# EAGLE design circle_barometer (EAGLE 7.4.0)
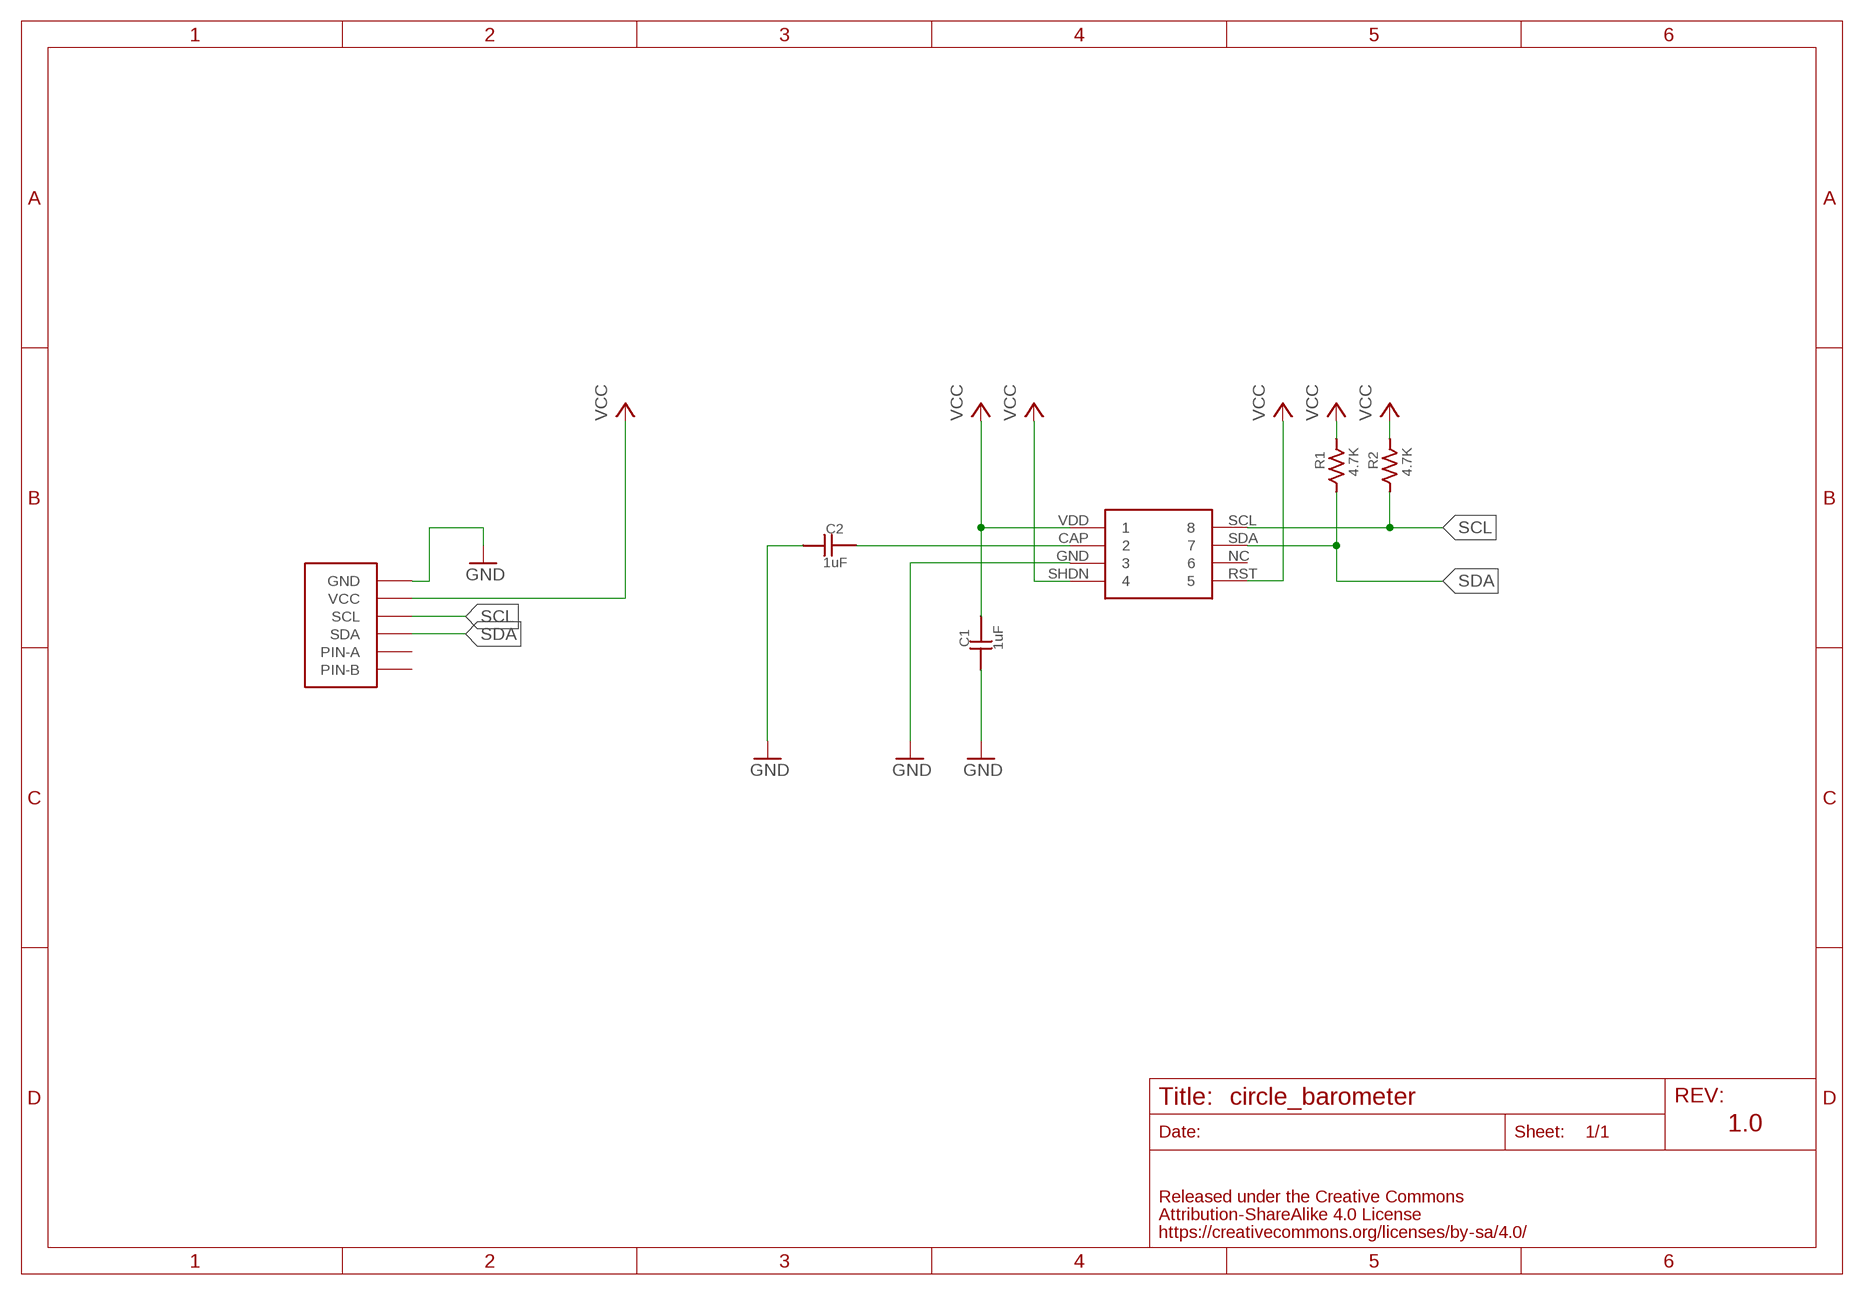
[diagram p0: schematic, sheet 1]

## Parts
C1  1uF  CAPACITOR0402  [0402]
C2  1uF  CAPACITOR0402  [0402]
R1  4.7K  RESISTOR-0402  [0402]
R2  4.7K  RESISTOR-0402  [0402]
U$2  I2C-MPL115A2  [I2C-MLP115A2]
U$4  FABO-NANO  [FABO-NANO]

## Nets
GND: C1.P$1 C2.P$1 U$2.GND U$4.GND
N$1: C2.P$2 U$2.CAP
SCL: R2.P$1 U$2.SCL U$4.0(SCL)
SDA: R1.P$1 U$2.SDA U$4.1(SDA)
VCC: C1.P$2 R1.P$2 R2.P$2 U$2.RST U$2.SHDN U$2.VDD
Unconnected: U$2.NC U$4.2(PIN-A) U$4.3(PIN-B) U$4.VCC

## Notes on the sheet
- 1.0

## Library data of the parts
C1 C2 = FaBo-Capacitor:CAPACITOR: CAPACITOR
R1 R2 = FaBo-Resistors:RESISTOR: RESISTOR
U$2 = gclue:I2C-MPL115A2
U$4 = FaBo-Template:FABO-NANO

## Board
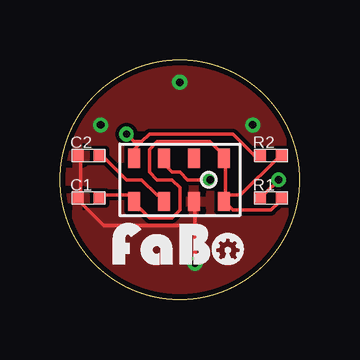
[diagram p1: board, top side]
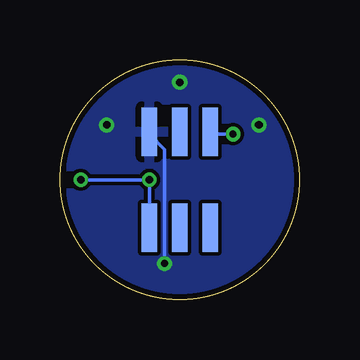
[diagram p2: board, bottom side, seen from below]

Size 10 x 10 mm. Coordinates in mm from the lower left corner, seen from the top.
Copper layers (1*16): Top 0.035mm / dielectric 1.5mm / Bottom 0.035mm
Design rules "SeeedStudio_2layer_DRU_no_angle_20140221": minimum track width 6mil, minimum drill 12mil, track to track 6mil, track to pad 6mil, pad to pad 6mil, via to via 6mil, smd to smd 0mil, copper to edge 10mil, drill to drill 10mil, minimum pad ring 10mil, minimum via ring 6mil, stop-mask expansion 2mil, vias tented up to drill 100mil, thermal gap 10mil

### Footprints (pad centres in the part's own frame; a part is rotated, then mirrored left to right if it is on the bottom)
0402 = smd 0.5 x 0.5: P$1 -0.46,0; P$2 0.46,0
I2C-MLP115A2 = smd 0.8 x 0.5: CAP -0.9,0.65; GND -0.9,-0.6; NC 0.9,-0.6; RST 0.9,-1.85; SCL 0.9,1.9; SDA 0.9,0.65; SHDN -0.9,-1.85; VDD -0.9,1.9
FABO-NANO = smd 0.635 x 2.032 bottom: 0 -1.27,2; 1 1.27,-2; 2 0,-2; 3 -1.27,-2; GND 1.27,2; VCC 0,2

### Placement (x,y rotation side)
C1  1.19,4.24 0 top
C2  1.19,6.02 0 top
R1  8.81,4.24 0 top
R2  8.81,6.02 0 top
U$2  5,5 90 top
U$3  [LOGO_FABO_S]  5,1.44 0 top
U$4  5,5 0 top

### Tracks (layer width: path | path; a pad name or v marks a point on that pad's centre or on a via)
GND  (via drill 0.3, 0.32)
  Top 0.152: C2.P$1 0.87,5.95 0.87,4.37 C1.P$1 0.87,4.05 1.82,3.09 5.63,3.09 | 5.63,3.09 5.63,4.05 U$2.GND | 5.63,3.09 v5.63,1.51
  Bottom 0.152: v5.63,1.51 5.63,6.27 6.27,6.91 U$4.GND
  other vias: 1.7,7.29 5,9.06 8.05,7.29
  pour Top: -0.08,-0.08 10.08,-0.08 10.08,10.08 -0.08,10.08
  pour Bottom: -0.08,-0.08 10.08,-0.08 10.08,10.08 -0.08,10.08
N$1
  Top 0.152: C2.P$2 1.82,5.95 2.78,5 3.41,5 4.05,4.37 4.37,4.37 U$2.CAP
SCL  (via drill 0.3)
  Top 0.152: 3.41,6.59 3.09,6.27 3.09,5.95 U$2.SCL | 3.41,6.59 3.73,6.91 7.22,6.91 8.18,5.95 R2.P$1 | v2.78,6.91 3.09,6.59 3.41,6.59
  Bottom 0.152: v2.78,6.91 3.73,6.91 U$4.0
SDA  (via drill 0.3)
  Top 0.152: v9.13,5 8.49,4.37 R1.P$1 | v6.27,5 5.32,5 5,5.32 4.68,5.32 4.37,5.63 U$2.SDA
  Bottom 0.152: v9.13,5 v6.27,5 U$4.1
VCC
  Top 0.152: C1.P$2 1.82,4.37 3.09,4.37 U$2.VDD 3.09,4.05 3.73,3.41 4.68,3.41 5,3.73 5,4.68 4.68,5 4.05,5 3.73,5.32 3.73,6.27 4.05,6.59 6.27,6.59 6.91,5.95 U$2.RST 6.91,5.63 6.91,4.37 | R1.P$2 9.13,4.05 8.81,3.73 7.22,3.73 6.91,4.05 U$2.SHDN 6.91,4.37 | 6.91,4.37 7.54,4.37 9.13,5.95 R2.P$2